# EAGLE design aprs_v1 (EAGLE 9.6.2)
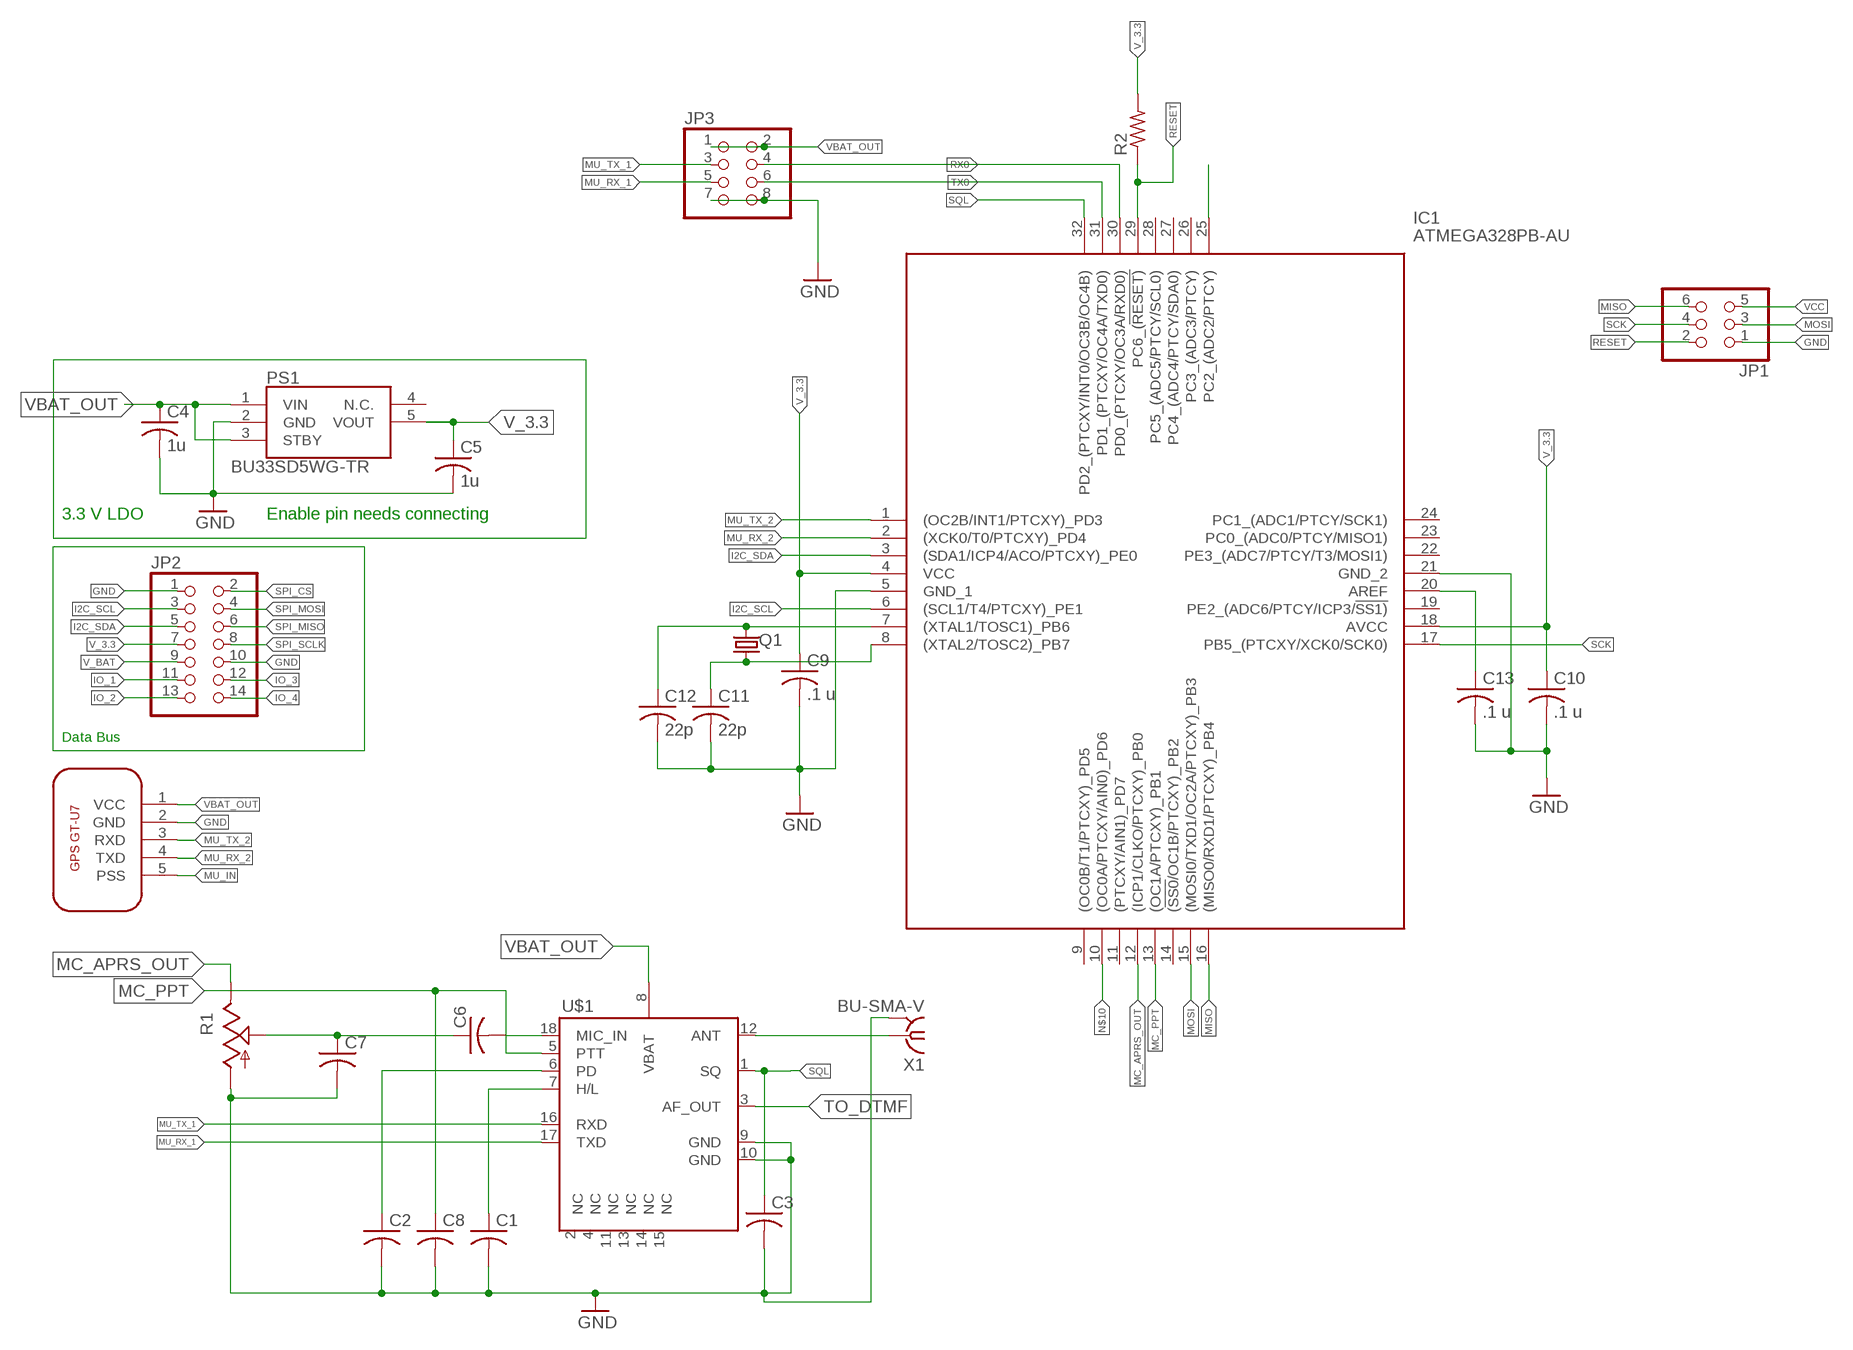
[diagram p0: schematic, sheet 1]

## Parts
C1  C-USC0805  [C0805]
C2  C-USC0805  [C0805]
C3  C-USC0805  [C0805]
C4  1u  C-USC0805  [C0805]
C5  1u  C-USC0805  [C0805]
C6  C-USC0805  [C0805]
C7  C-USC0805  [C0805]
C8  C-USC0805  [C0805]
C9  .1 u  C-USC0805  [C0805]
C10  .1 u  C-USC0805  [C0805]
C11  22p  C-USC0805  [C0805]
C12  22p  C-USC0805  [C0805]
C13  .1 u  C-USC0805  [C0805]
IC1  ATMEGA328PB-AU  [QFP80P900X900X120-32N]
JP1  PINHD-2X3  [2X03]
JP2  PINHD-2X7  [2X07]
JP3  PINHD-2X4  [2X04]
PS1  BU33SD5WG-TR  [SOT95P280X125-5N]
Q1  CRYSTALHC49S  [HC49/S]
R1  TRIM_US-CA6V  [CA6V]
R2  R-US_M0805  [M0805]
U$1  DRA818A  [DRA818A]
U$2  GT-U7  [GPS_AHE]
X1  BU-SMA-V  [BU-SMA-V]

## Nets
GND [V_bat]: C1.2 C2.2 C3.2 C4.2 C5.2 C7.2 C8.2 C9.2 C10.2 C11.2 C12.2 C13.2 IC1.5(GND_1) IC1.21(GND_2) JP1.1 JP2.1 JP2.10 JP3.7 JP3.8 PS1.2(GND) R1.A U$1.9(GND) U$1.10(GND) U$2.2(GND) X1.2 X1.3 X1.4 X1.5
I2C_SCL: IC1.6((SCL1/T4/PTCXY)_PE1) JP2.3
I2C_SDA: IC1.3((SDA1/ICP4/ACO/PTCXY)_PE0) JP2.5
IO_1: JP2.11
IO_2: JP2.13
IO_3: JP2.12
IO_4: JP2.14
MC_APRS_OUT: IC1.12((ICP1/CLKO/PTCXY)_PB0) R1.E
MC_PPT: C8.1 IC1.13((OC1A/PTCXY)_PB1) U$1.5(PTT)
MISO: IC1.16((MISO0/RXD1/PTCXY)_PB4) JP1.6
MOSI: IC1.15((MOSI0/TXD1/OC2A/PTCXY)_PB3) JP1.3
MU_IN: U$2.5(PSS)
MU_RX_1: JP3.5 U$1.17(TXD)
MU_RX_2: IC1.2((XCK0/T0/PTCXY)_PD4) U$2.4(TXD)
MU_TX_1: JP3.3 U$1.16(RXD)
MU_TX_2: IC1.1((OC2B/INT1/PTCXY)_PD3) U$2.3(RXD)
N$1: C2.1 U$1.6(PD)
N$2: C1.1 U$1.7(H/L)
N$3 [50 ohm]: U$1.12(ANT) X1.1
N$4: C6.2 U$1.18(MIC_IN)
N$5: C13.1 IC1.20(AREF)
N$7: C6.1 C7.1 R1.S
N$8: C12.1 IC1.7((XTAL1/TOSC1)_PB6) Q1.2
N$9: C11.1 IC1.8((XTAL2/TOSC2)_PB7) Q1.1
N$10: IC1.10((OC0A/PTCXY/AIN0)_PD6)
N$12: IC1.25(PC2_(ADC2/PTCY))
RESET: IC1.29(PC6_(!RESET)) JP1.2 R2.1
RX0: IC1.30(PD0_(PTCXY/OC3A/RXD0)) JP3.4
SCK: IC1.17(PB5_(PTCXY/XCK0/SCK0)) JP1.4
SPI_CS: JP2.2
SPI_MISO: JP2.6
SPI_MOSI: JP2.4
SPI_SCLK: JP2.8
SQL: C3.1 IC1.32(PD2_(PTCXY/INT0/OC3B/OC4B)) U$1.1(SQ)
TO_DTMF: U$1.3(AF_OUT)
TX0: IC1.31(PD1_(PTCXY/OC4A/TXD0)) JP3.6
V_3.3 [PWR]: C5.1 C9.1 C10.1 IC1.4(VCC) IC1.18(AVCC) JP2.7 PS1.5(VOUT) R2.2
V_BAT [PWR]: JP2.9
VBAT_OUT: C4.1 JP3.1 JP3.2 PS1.1(VIN) PS1.3(STBY) U$1.8(VBAT) U$2.1(VCC)
VCC: JP1.5
Unconnected: IC1.9((OC0B/T1/PTCXY)_PD5) IC1.11((PTCXY/AIN1)_PD7) IC1.14((!SS0!/OC1B/PTCXY)_PB2) IC1.19(PE2_(ADC6/PTCY/ICP3/!SS1)) IC1.22(PE3_(ADC7/PTCY/T3/MOSI1)) IC1.23(PC0_(ADC0/PTCY/MISO1)) IC1.24(PC1_(ADC1/PTCY/SCK1)) IC1.26(PC3_(ADC3/PTCY)) IC1.27(PC4_(ADC4/PTCY/SDA0)) IC1.28(PC5_(ADC5/PTCY/SCL0)) PS1.4(N.C.) U$1.2(NC) U$1.4(NC) U$1.11(NC) U$1.13(NC) U$1.14(NC) U$1.15(NC)

## Notes on the sheet
- 3.3 V LDO | Enable pin needs connecting
- Data Bus

## Library data of the parts
C1-C13 = rcl:C-US: CAPACITOR, American symbol; SPICEPREFIX: C
IC1 = ATMEGA328PB-AU:ATMEGA328PB-AU: ATMEL - ATMEGA328PB-AU - MCU, 8BIT, ATMEGA, 20MHZ, TQFP-32 Source: Datasheet; DESCRIPTION: ATMEL - ATMEGA328PB-AU - MCU, 8BIT, ATMEGA, 20MHZ, TQFP-32; HEIGHT: 1.2mm; MANUFACTURER_NAME: Microchip; MANUFACTURER_PART_NUMBER: ATMEGA328PB-AU; MOUSER_PART_NUMBER: 556-ATMEGA328PB-AU; MOUSER_PRICE-STOCK: https://www.mouser.co.uk/ProductDetail/Microchip-Technology-Atmel/ATMEGA328PB-AU?qs=jy4bLUHv09hbFONgGrqPbw%3D%3D
JP1 = pinhead:PINHD-2X3: PIN HEADER
JP2 = pinhead:PINHD-2X7: PIN HEADER
JP3 = pinhead:PINHD-2X4: PIN HEADER
PS1 = BU33SD5WG-TR:BU33SD5WG-TR: LDO regulator,3.3V,0.5A,standby,SSOP5 ROHM BU33SD5WG-TR, LDO Voltage Regulator, 0.5A, 3.3 V +/-2%, 1.7 6 Vin, 5-Pin SSOP Source: Datasheet <https://componentsearchengine.com/Datasheets/1/BU33SD5WG-TR.pdf>; DESCRIPTION: LDO regulator,3.3V,0.5A,standby,SSOP5 ROHM BU33SD5WG-TR, LDO Voltage Regulator, 0.5A, 3.3 V +/-2%, 1.7 6 Vin, 5-Pin SSOP; HEIGHT: 1.25mm; MANUFACTURER_NAME: ROHM Semiconductor; MANUFACTURER_PART_NUMBER: BU33SD5WG-TR; MOUSER_PART_NUMBER: 755-BU33SD5WG-TR; MOUSER_PRICE-STOCK: https://www.mouser.co.uk/ProductDetail/ROHM-Semiconductor/BU33SD5WG-TR?qs=%2FKR40Cd6GUrQDzRkUEt69Q%3D%3D
Q1 = adafruit:CRYSTAL: CRYSTAL; OC_FARNELL: 1667008; OC_NEWARK: unknown
R1 = pot:TRIM_US-: POTENTIOMETER
R2 = rcl:R-US_: RESISTOR, American symbol; SPICEPREFIX: R
U$1 = dorji:DRA818A
U$2 = GPS_ahe:GT-U7
X1 = con-coax:BU-SMA-V: FEMALE SMA CONNECTOR Radiall distributor RS 112-3794; OC_FARNELL: unknown; OC_NEWARK: unknown

## Net classes
0 default: width 0.254 mm, clearance 0.152 mm
1 PWR: width 0.254 mm, clearance 0.152 mm
2 V_bat: width 0.305 mm, clearance 0.152 mm
3 50 ohm: width 1.21 mm, clearance 0.26 mm

## Board
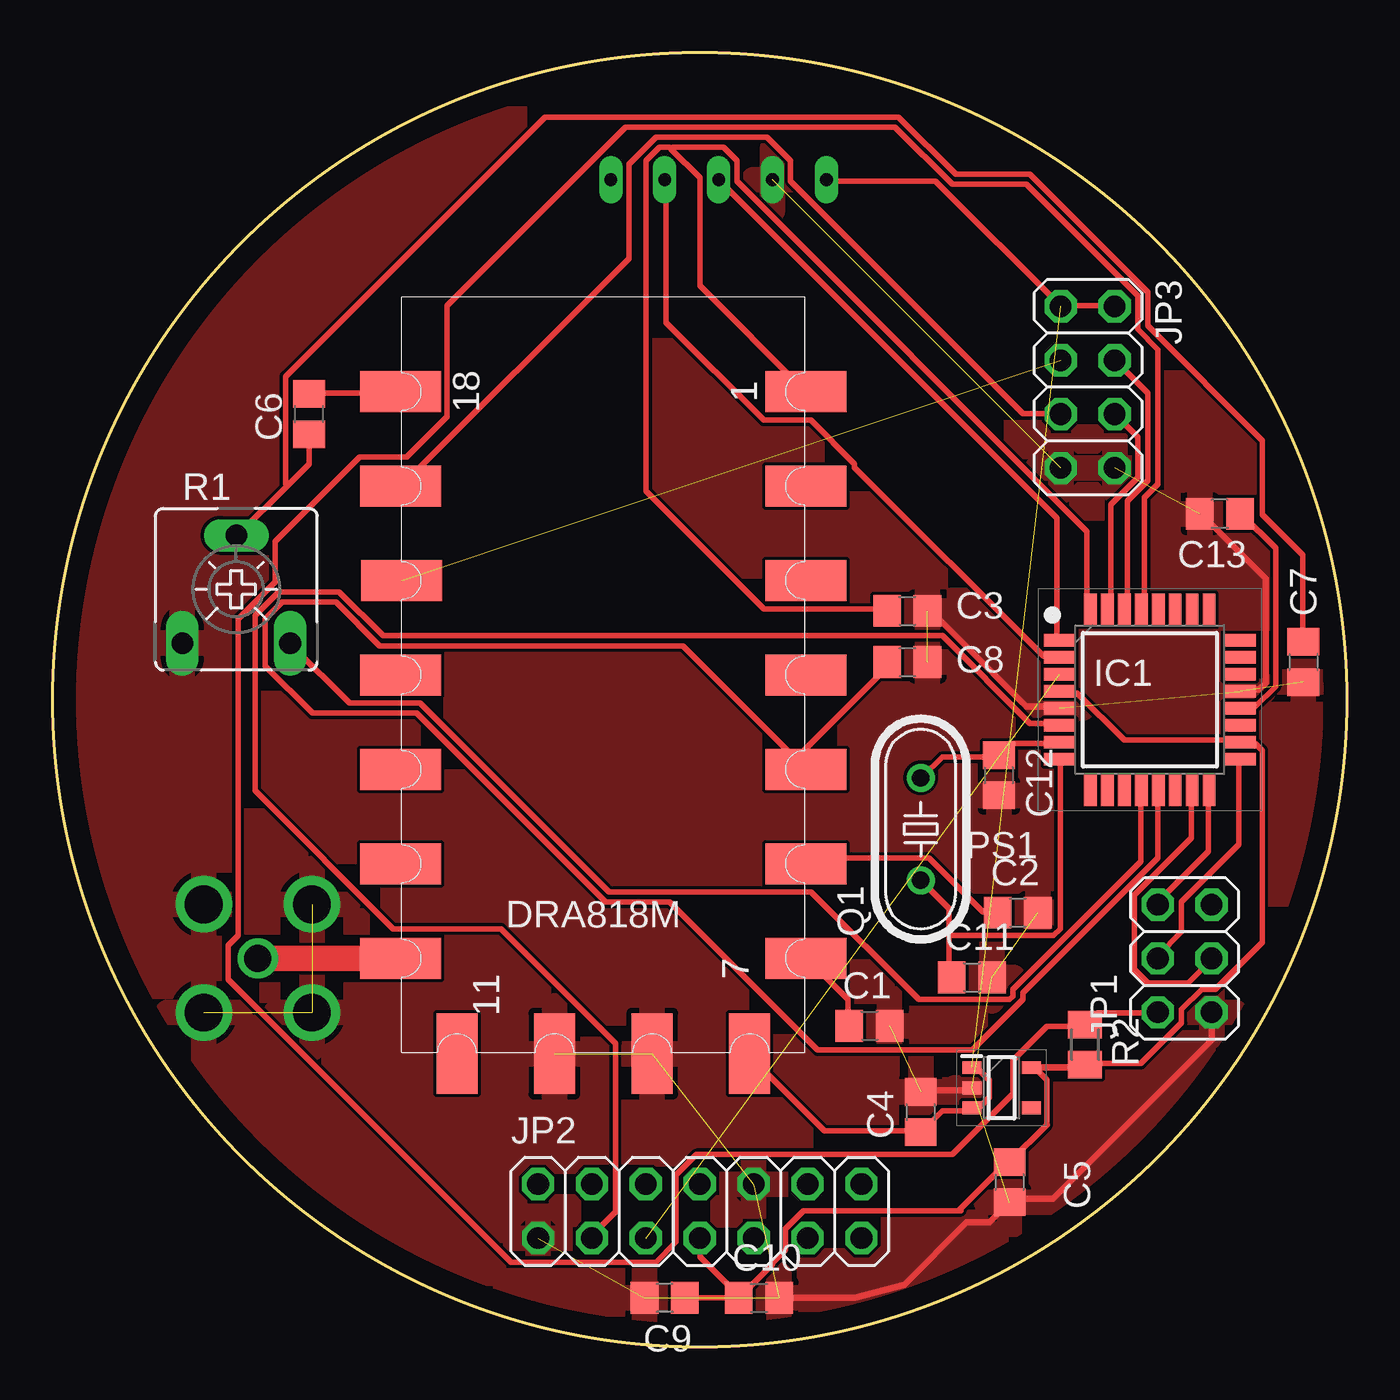
[diagram p1: board, top side]
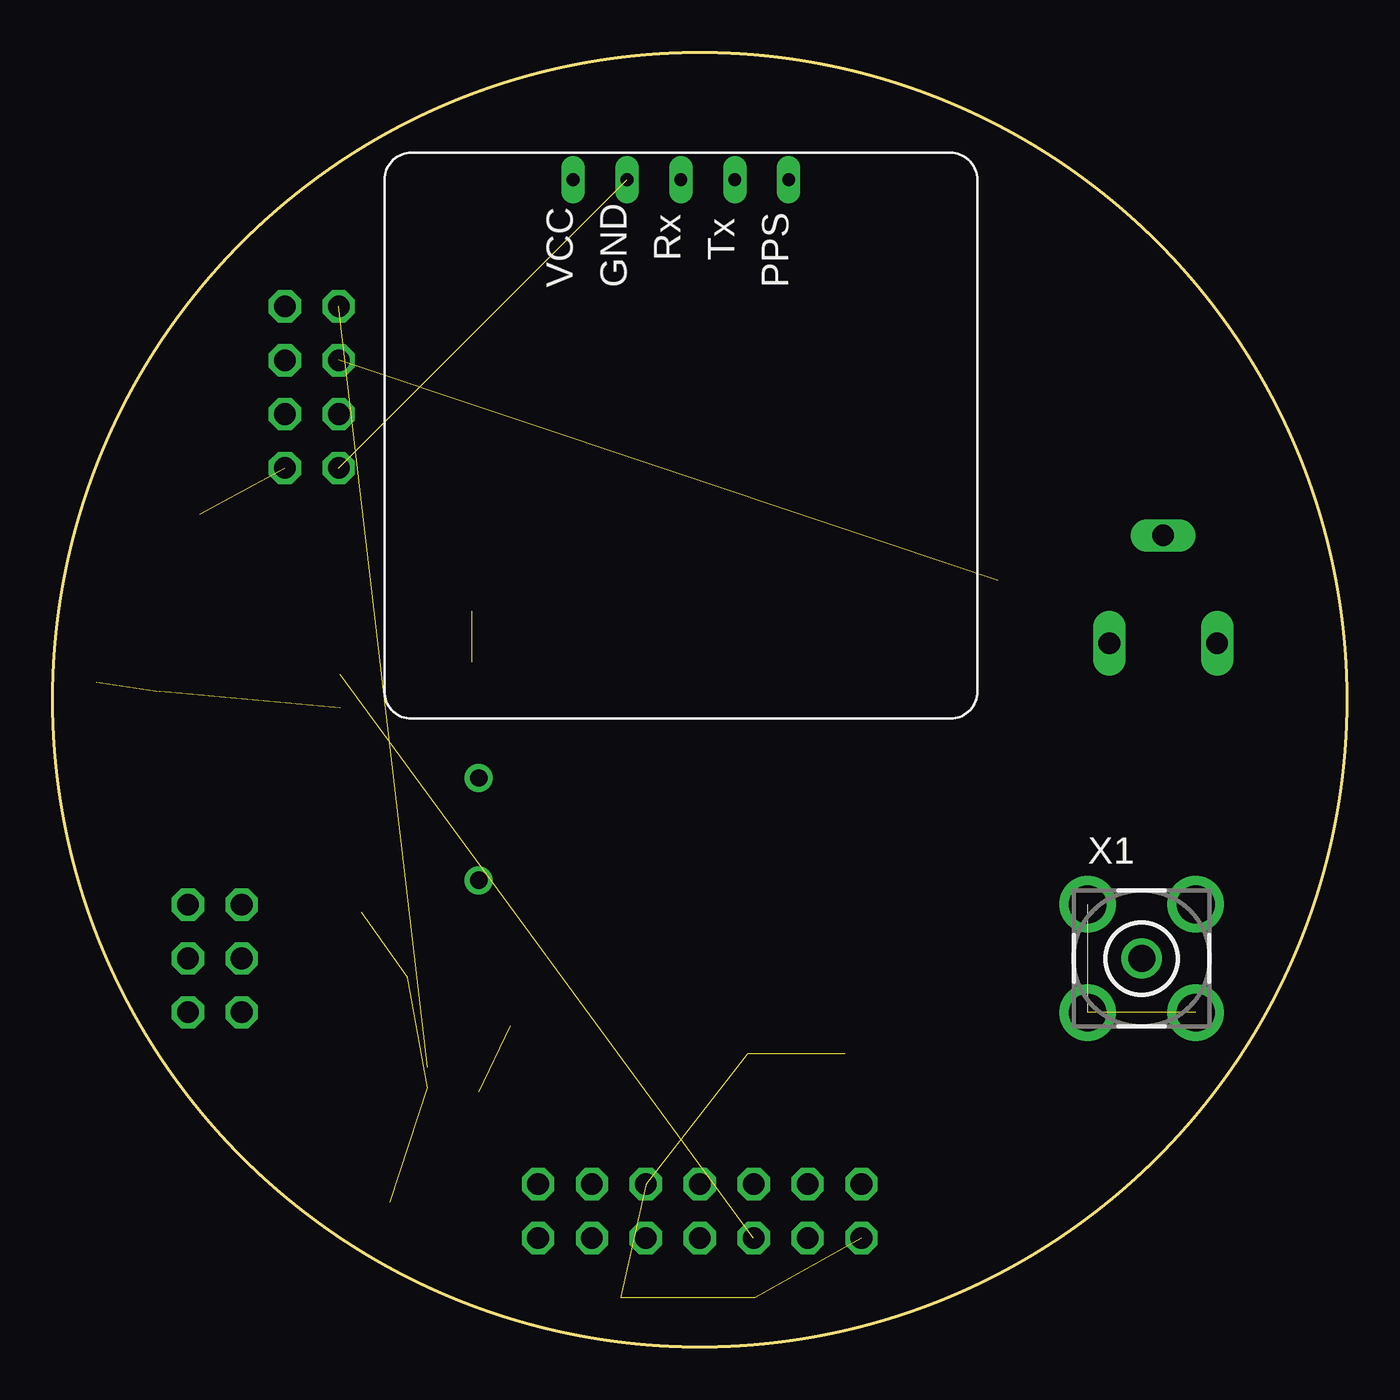
[diagram p2: board, bottom side, seen from below]

Size 60.96 x 60.96 mm. Coordinates in mm from the lower left corner, seen from the top.
Outline: circle at 30.48,30.48 radius 30.48
Copper layers (1*16): Top 0.035mm / dielectric 1.5mm / Bottom 0.035mm
Design rules "default": minimum track width 6mil, minimum drill 0.35mm, track to track 6mil, track to pad 6mil, pad to pad 6mil, via to via 6mil, smd to smd 6mil, copper to edge 40mil, drill to drill 6mil, minimum pad ring 10mil, minimum via ring 8mil, stop-mask expansion 4mil, vias tented up to drill 0mil, thermal gap 10mil

### Footprints (pad centres in the part's own frame; a part is rotated, then mirrored left to right if it is on the bottom)
C0805 = smd 1.3 x 1.5: 1 -0.95,0; 2 0.95,0
QFP80P900X900X120-32N = smd 1.5 x 0.6: 1 -4.25,2.8; 2 -4.25,2; 3 -4.25,1.2; 4 -4.25,0.4; 5 -4.25,-0.4; 6 -4.25,-1.2; 7 -4.25,-2; 8 -4.25,-2.8; 17 4.25,-2.8; 18 4.25,-2; 19 4.25,-1.2; 20 4.25,-0.4; 21 4.25,0.4; 22 4.25,1.2; 23 4.25,2; 24 4.25,2.8 | smd 0.6 x 1.5: 9 -2.8,-4.25; 10 -2,-4.25; 11 -1.2,-4.25; 12 -0.4,-4.25; 13 0.4,-4.25; 14 1.2,-4.25; 15 2,-4.25; 16 2.8,-4.25; 25 2.8,4.25; 26 2,4.25; 27 1.2,4.25; 28 0.4,4.25; 29 -0.4,4.25; 30 -1.2,4.25; 31 -2,4.25; 32 -2.8,4.25
2X03 = drill 1.016 octagon: 1 -2.54,-1.27; 2 -2.54,1.27; 3 0,-1.27; 4 0,1.27; 5 2.54,-1.27; 6 2.54,1.27
2X07 = drill 1.016 octagon: 1 -7.62,-1.27; 2 -7.62,1.27; 3 -5.08,-1.27; 4 -5.08,1.27; 5 -2.54,-1.27; 6 -2.54,1.27; 7 0,-1.27; 8 0,1.27; 9 2.54,-1.27; 10 2.54,1.27; 11 5.08,-1.27; 12 5.08,1.27; 13 7.62,-1.27; 14 7.62,1.27
2X04 = drill 1.016 octagon: 1 -3.81,-1.27; 2 -3.81,1.27; 3 -1.27,-1.27; 4 -1.27,1.27; 5 1.27,-1.27; 6 1.27,1.27; 7 3.81,-1.27; 8 3.81,1.27
SOT95P280X125-5N = smd 0.9 x 0.6: 1 -1.4,0.95; 2 -1.4,0; 3 -1.4,-0.95; 4 1.4,-0.95; 5 1.4,0.95
HC49/S = drill 0.813: 1 -2.413,0; 2 2.413,0
CA6V = drill 1.016 long: A -2.54,-2.54; E 2.54,-2.54; S 0,2.54
M0805 = smd 1.3 x 1.6: 1 -0.95,0; 2 0.95,0
DRA818A = smd 3.81 x 1.93: 1 -9.45,-13.25; 2 -9.45,-8.8; 3 -9.45,-4.35; 4 -9.45,0.1; 5 -9.45,4.55; 6 -9.45,9; 7 -9.45,13.45; 12 9.65,13.45; 13 9.65,9; 14 9.65,4.55; 15 9.65,0.1; 16 9.6,-4.35; 17 9.65,-8.8; 18 9.65,-13.25 | smd 1.93 x 3.81: 8 -6.8,17.95; 9 -2.2,17.95; 10 2.4,17.95; 11 7,17.95
GPS_AHE = drill 0.6 long: 1 -7.62,0; 2 -5.08,0; 3 -2.54,0; 4 0,0; 5 2.54,0
BU-SMA-V = drill 1.27: 1 0,0 | drill 1.778: 2 -2.55,2.55; 3 2.55,2.55; 4 2.55,-2.55; 5 -2.55,-2.55

### Placement (x,y rotation side)
C1  38.48,15.11 0 top
C2  45.47,20.45 0 top
C3  40.26,34.67 0 top
C4  40.89,11.05 90 top
C5  45.09,7.75 270 top
C6  12.06,43.94 90 top
C7  58.93,32.26 270 top
C8  40.26,32.26 0 top
C9  28.83,2.29 180 top
C10  33.27,2.29 0 top
C11  43.31,17.4 0 top
C12  44.58,26.92 270 top
C13  54.99,39.24 180 top
IC1  51.69,30.48 0 top
JP1  53.34,18.29 90 top
JP2  30.48,6.38 0 top
JP3  48.77,45.21 270 top
PS1  44.7,12.19 0 top
Q1  40.89,24.38 90 top
R1  8.64,35.69 0 top
R2  48.64,14.22 270 top
U$1  26.04,31.75 180 top
U$2  28.83,54.99 0 bottom
X1  9.65,18.29 0 bottom

### Tracks (layer width: path | path; a pad name or v marks a point on that pad's centre or on a via)
GND  (16 unrouted)
  Top 0.305: PS1.2 43.18,12.06 40.96,12.06 C4.2 | IC1.5 47.31,30.16 45.88,30.16 41.27,34.77 C3.2 | IC1.21 56.04,30.96 56.83,30.96 57.15,31.27 57.15,36.2 54.13,39.21 C13.2 | JP1.1 54.61,14.45 47.12,6.95 45.24,6.95 C5.2 44.13,5.84 43.05,5.84 40.12,2.91 37.79,2.29 C10.2
  pour Top: -1.52,-1.91 64.64,-1.91 64.64,62.23 -1.52,62.23
I2C_SCL
  Top 0.254: IC1.6 47.31,29.37 46.04,29.37 41.91,33.5 15.56,33.5 13.49,35.56 10.64,35.56 9.53,34.45 9.53,26.19 16.03,19.68 21.11,19.68 26.51,14.29 26.51,6.35 25.4,5.24 JP2.3
I2C_SDA  (1 unrouted)
MC_APRS_OUT
  Top 0.254: IC1.12 51.28,26.19 51.28,22.86 45.24,16.83 45.24,16.51 45.09,16.35 40.8,16.35 35.72,21.43 26.19,21.43 17.3,30.32 13.97,30.32 11.27,33.02 R1.E
MC_PPT
  Top 0.254: IC1.13 52.07,26.19 52.07,23.02 45.72,16.67 45.72,16.35 43.34,13.97 36.04,13.97 29.05,20.95 26.04,20.95 17.14,29.84 12.22,29.84 10,32.07 10,34.29 10.79,35.08 13.34,35.08 15.4,33.02 29.69,33.02 35.4,27.3 U$1.5 35.08,27.78 39.21,31.91 39.21,32.23 C8.1
MISO
  Top 0.254: IC1.16 54.45,26.19 54.45,23.34 52.07,20.95 JP1.6
MOSI
  Top 0.254: IC1.15 53.66,26.19 53.66,23.97 50.96,21.27 50.96,17.78 51.59,17.14 53.5,17.14 54.61,18.26 JP1.3
MU_RX_1
  Top 0.254: JP3.5 47.47,43.97 45.72,43.97 34.77,54.93 34.77,55.88 33.66,56.99 28.42,56.99 27.15,55.72 27.15,51.28 16.51,40.64 U$1.17
MU_RX_2
  Top 0.254: IC1.2 47.31,32.54 46.67,32.54 37.78,41.43 37.78,41.59 35.72,43.66 33.5,43.66 28.89,48.26 28.89,54.93 U$2.4
MU_TX_1  (1 unrouted)
MU_TX_2
  Top 0.254: U$2.3 47.31,39.05 47.31,33.34 IC1.1
N$1
  Top 0.254: C2.1 44.45,20.48 43.81,20.48 41.27,23.02 35.72,23.02 35.56,22.86 U$1.6
N$2
  Top 0.254: C1.1 37.47,15.24 37.47,16.35 35.56,18.26 U$1.7
N$3
  Top 1.21: X1.1 16.51,18.29 | 16.51,18.29 17.14,18.29 17.27,18.16 | U$1.12 16.51,18.26 16.51,18.29
N$4
  Top 0.254: C6.2 12.06,44.93 16.35,44.93 U$1.18
N$5
  Top 0.254: IC1.20 56.04,30.16 56.67,30.16 57.63,31.11 57.63,37.62 56.04,39.21 C13.1
N$7
  Top 0.254: C6.1 12.06,41.59 11.03,40.56 | 11.03,40.56 8.73,38.26 R1.S | C7.1 58.9,33.34 58.9,37.31 56.99,39.21 56.99,42.7 51.59,48.1 51.59,49.69 46.04,55.24 42.55,55.24 39.85,57.94 23.18,57.94 10.95,45.72 10.95,40.64 11.03,40.56
N$8
  Top 0.254: Q1.2 40.96,26.83 41.91,27.78 44.45,27.78 C12.1 44.61,27.94 45.09,28.42 47.31,28.42 IC1.7
N$9
  Top 0.254: 42.23,19.37 42.23,20.64 Q1.1 | 42.23,19.37 42.23,17.46 C11.1 | 42.23,19.37 47.15,19.37 47.47,19.68 47.47,27.62 IC1.8
RESET
  Top 0.254: IC1.29 51.44,34.77 51.44,40.01 52.07,40.64 52.07,46.99 51.12,47.94 51.12,49.53 45.88,54.77 42.39,54.77 39.69,57.47 26.99,57.47 18.57,49.05 18.57,43.81 16.67,41.91 14.45,41.91 10.48,37.94 10.48,36.04 8.73,34.29 8.73,19.37 8.26,18.89 8.26,17.3 21.59,3.97 28.42,3.97 29.37,4.92 29.37,8.1 30.32,9.05 42.39,9.05 45.24,11.91 45.24,13.49 46.83,15.08 48.58,15.08 R2.1 48.74,15.24 49.21,15.72 52.07,15.72 JP1.2
RX0
  Top 0.254: JP3.4 51.59,44.93 51.59,40.8 50.64,39.85 50.64,34.77 IC1.30
SCK
  Top 0.254: IC1.17 55.88,27.62 55.88,23.65 53.18,20.95 53.18,19.53 52.07,18.41 JP1.4
SQL
  Top 0.254: 29.13,56.44 30.48,55.09 30.48,50.01 35.4,45.09 U$1.1 | 29.13,56.44 29.05,56.52 28.57,56.52 27.94,55.88 27.94,40.32 33.5,34.77 39.21,34.77 C3.1 | IC1.32 48.74,34.77 48.74,38.42 32.23,54.93 32.23,55.88 31.59,56.52 29.21,56.52 29.13,56.44
TX0
  Top 0.254: JP3.6 51.12,42.86 51.12,40.96 49.85,39.69 49.85,34.77 IC1.31
V_3.3
  Top 0.254: IC1.4 47.47,30.8 48.26,30.8 50.48,28.57 55.88,28.57 IC1.18 56.04,28.42 56.67,28.42 56.99,28.1 56.99,19.05 54.77,16.83 54.13,16.83 53.18,15.88 53.18,15.24 51.28,13.34 48.74,13.34 R2.2 | JP2.7 30.48,4.23 32.32,2.39 C10.1 | 33.91,3.97 33.91,3.94 | 33.91,3.94 33.91,3.87 C10.1 | C9.1 C10.1 | PS1.5 46.25,13.14 46.83,12.56 46.83,10.45 | 33.91,3.94 34.52,4.55 34.52,5.54 35.38,6.4 42.67,6.4 | 42.67,6.4 42.79,6.4 | 42.67,6.4 44.97,8.7 C5.1
  Top 0.305: PS1.5 48.51,13.14 R2.2 | 46.83,10.45 C5.1
VBAT_OUT  (1 unrouted)
  Top 0.254: PS1.1 43.34,13.02 43.66,13.02 44.13,12.54 44.13,11.75 43.66,11.27 43.34,11.27 PS1.3 43.18,11.11 41.91,11.11 40.96,10.16 C4.1 40.8,10.16 36.35,10.16 32.86,13.65 U$1.8 | U$2.1 36.51,54.93 41.59,54.93 JP3.1 47.62,49.05 50.01,49.05 JP3.2